# EAGLE design programmer (EAGLE 9.6.2)
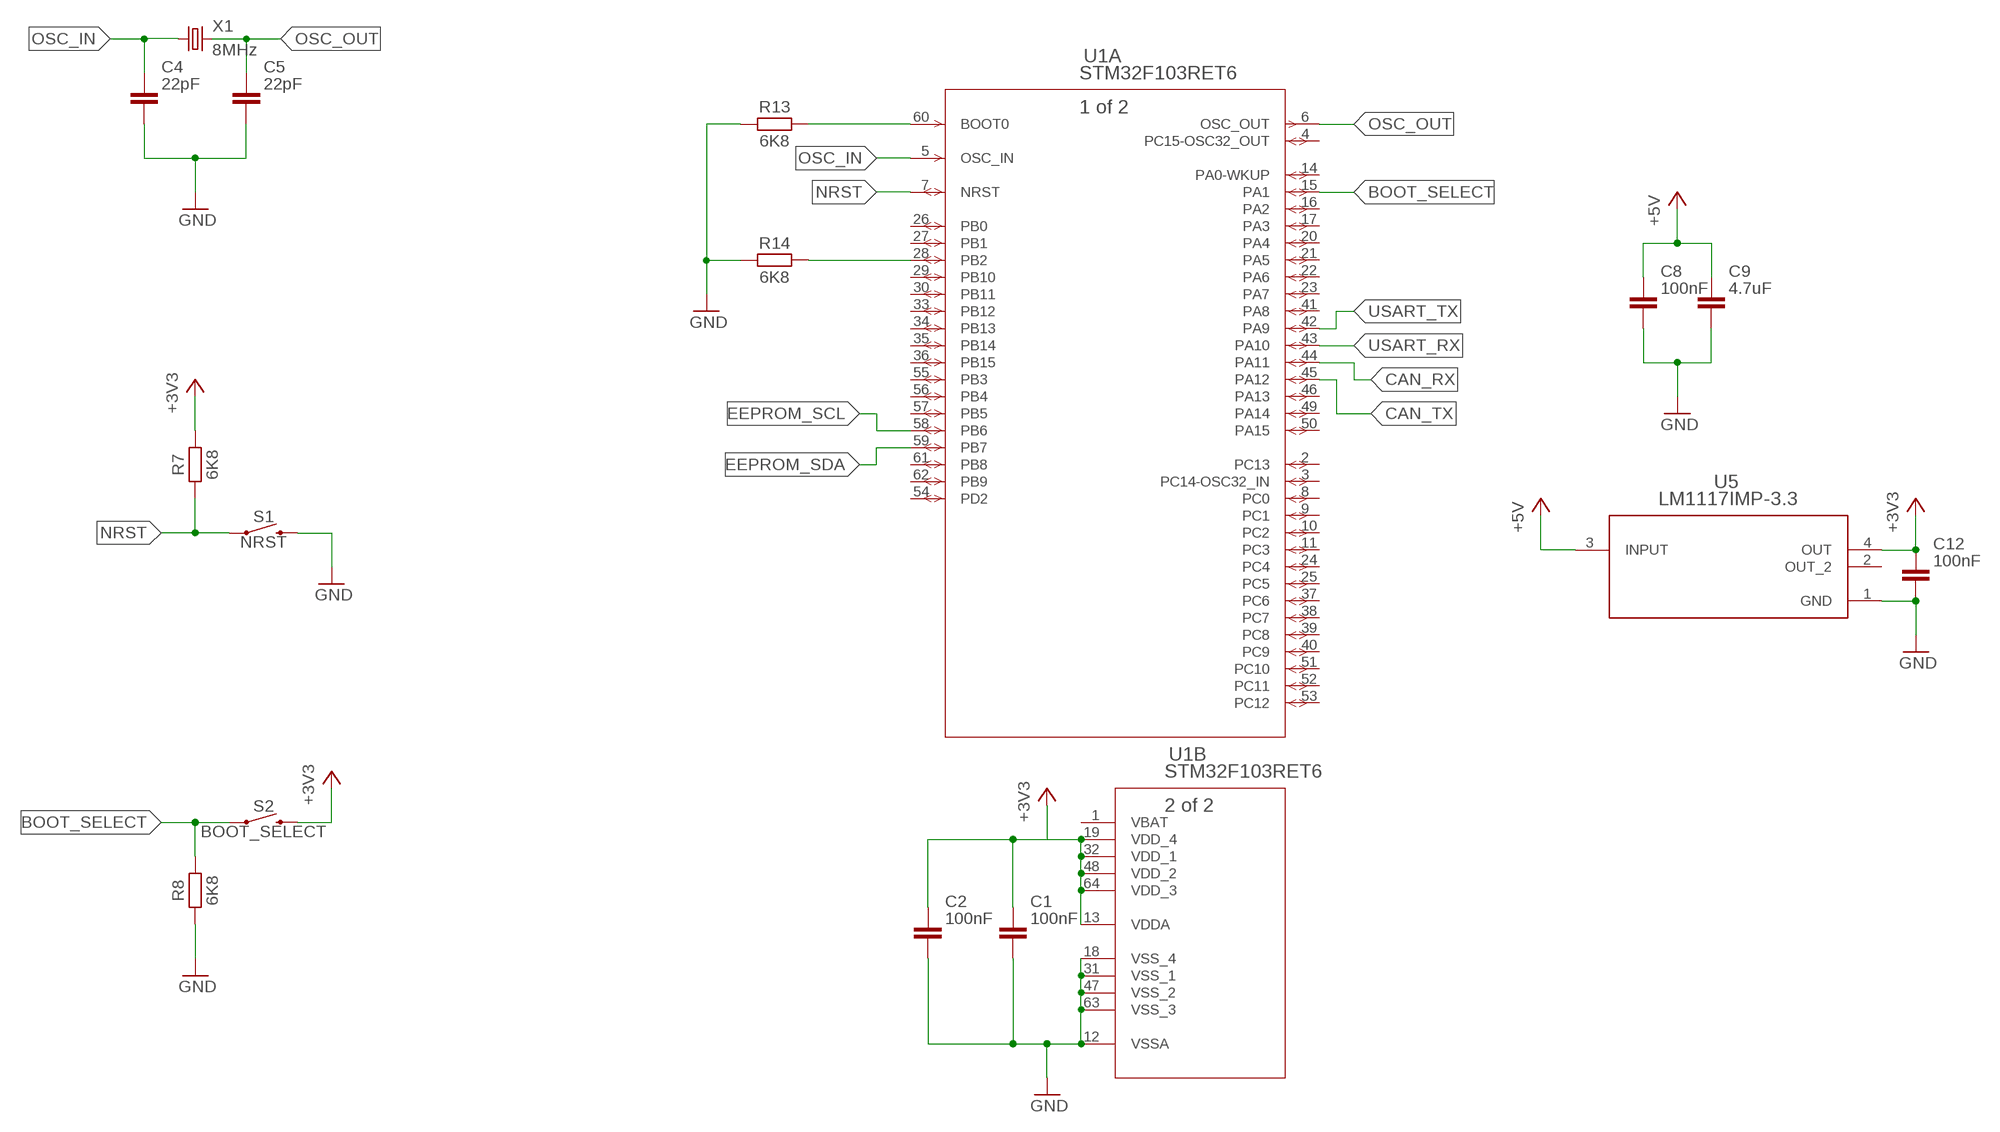
[diagram p0: schematic, sheet 1, part 1 of 2]
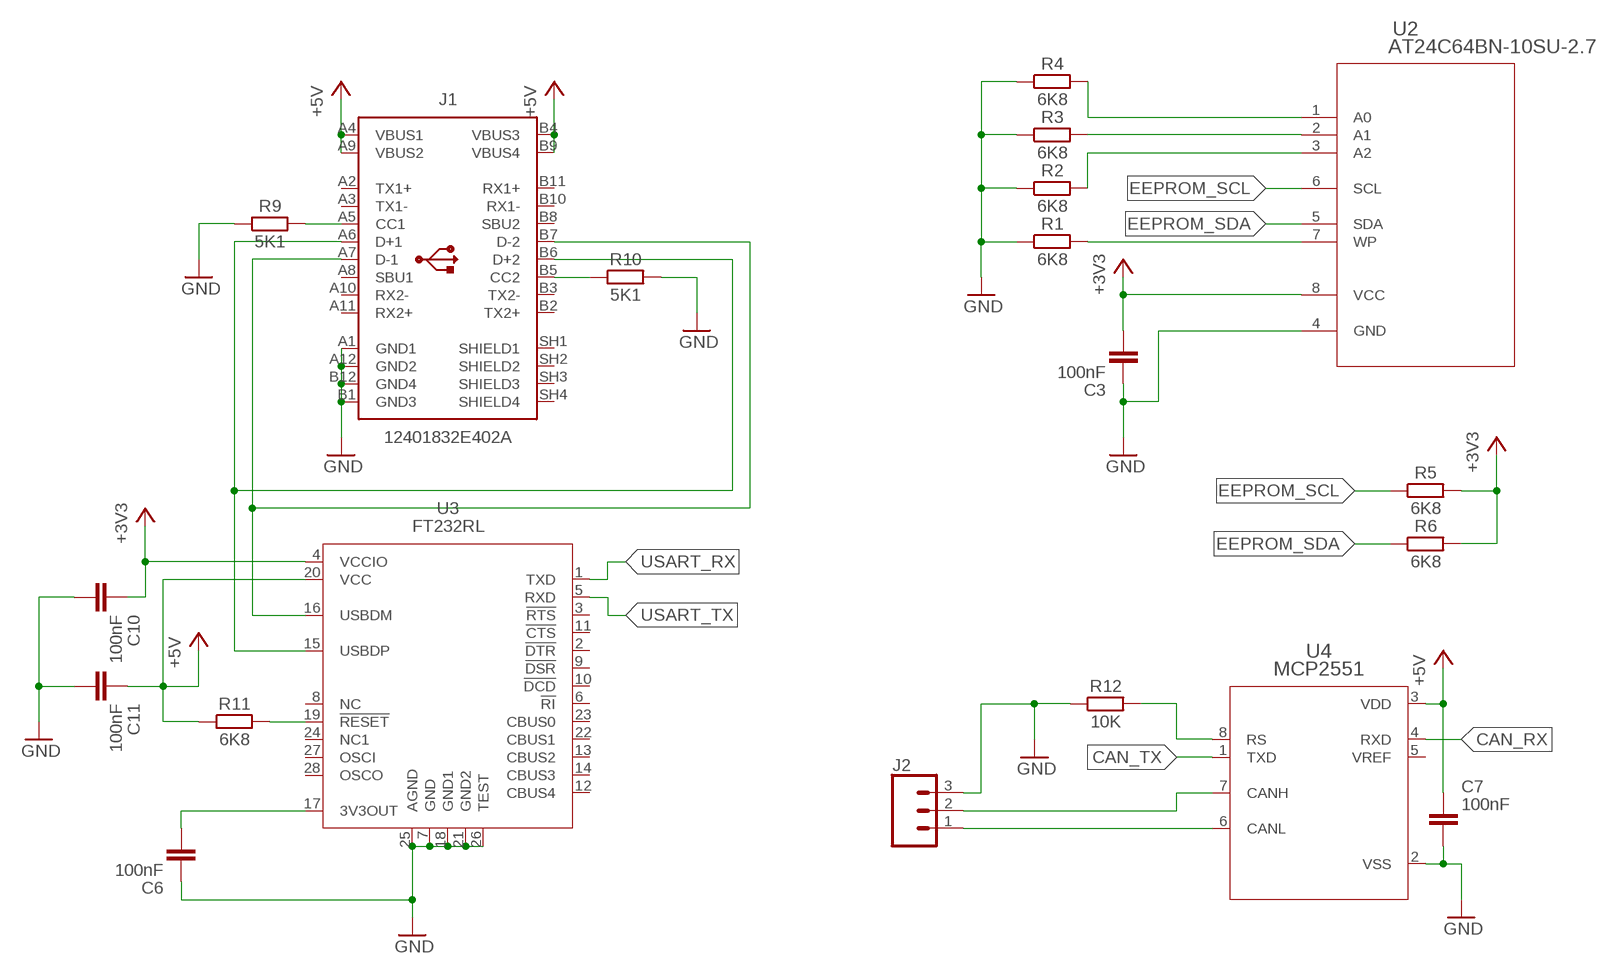
[diagram p1: schematic, sheet 1, part 2 of 2]

## Parts
C1  100nF  C_CHIP-0805(2012-METRIC)  [CAPC2012X110]
C2  100nF  C_CHIP-0805(2012-METRIC)  [CAPC2012X110]
C3  100nF  C_CHIP-0805(2012-METRIC)  [CAPC2012X110]
C4  22pF  C_CHIP-0805(2012-METRIC)  [CAPC2012X110]
C5  22pF  C_CHIP-0805(2012-METRIC)  [CAPC2012X110]
C6  100nF  C_CHIP-0805(2012-METRIC)  [CAPC2012X110]
C7  100nF  C_CHIP-0805(2012-METRIC)  [CAPC2012X110]
C8  100nF  C_CHIP-0805(2012-METRIC)  [CAPC2012X110]
C9  4.7uF  C_CHIP-0805(2012-METRIC)  [CAPC2012X110]
C10  100nF  C_CHIP-0805(2012-METRIC)  [CAPC2012X110]
C11  100nF  C_CHIP-0805(2012-METRIC)  [CAPC2012X110]
C12  100nF  C_CHIP-0805(2012-METRIC)  [CAPC2012X110]
J1  12401832E402A  [12401832E402A]
J2  CONN_03-SCREW-5MM  [SCREWTERMINAL-5MM-3]
R1  6K8  R_CHIP-0805(2012-METRIC)  [RESC2012X65]
R2  6K8  R_CHIP-0805(2012-METRIC)  [RESC2012X65]
R3  6K8  R_CHIP-0805(2012-METRIC)  [RESC2012X65]
R4  6K8  R_CHIP-0805(2012-METRIC)  [RESC2012X65]
R5  6K8  R_CHIP-0805(2012-METRIC)  [RESC2012X65]
R6  6K8  R_CHIP-0805(2012-METRIC)  [RESC2012X65]
R7  6K8  R_CHIP-0805(2012-METRIC)  [RESC2012X65]
R8  6K8  R_CHIP-0805(2012-METRIC)  [RESC2012X65]
R9  5K1  R_CHIP-0805(2012-METRIC)  [RESC2012X65]
R10  5K1  R_CHIP-0805(2012-METRIC)  [RESC2012X65]
R11  6K8  R_CHIP-0805(2012-METRIC)  [RESC2012X65]
R12  10K  R_CHIP-0805(2012-METRIC)  [RESC2012X65]
R13  6K8  R_CHIP-0805(2012-METRIC)  [RESC2012X65]
R14  6K8  R_CHIP-0805(2012-METRIC)  [RESC2012X65]
S1  NRST  MOMENTARY-SWITCH-SPST-SMD-6.0X3.5MM  [TACTILE_SWITCH_SMD_6.0X3.5MM]
S2  BOOT_SELECT  MOMENTARY-SWITCH-SPST-SMD-6.0X3.5MM  [TACTILE_SWITCH_SMD_6.0X3.5MM]
U1  STM32F103RET6  [LQFP64-10X10MM]
U2  AT24C64BN-10SU-2.7  [8S1_ATM]
U3  FT232RL  FT232RL_SSOP  [SSOP28]
U4  MCP2551  MCP2551_SOIC  [SOIC127P599X175-8]
U5  LM1117IMP-3.3  LM1117IMP-3.3/NOPB  [DCY0004A_N]
X1  8MHz  CRYSTALS-NOGND-4-HSMX  [HC49-4-HSMX]

## Nets
+3V3: C1.1 C2.1 C3.2 C10.1 C12.1 R5.2 R6.2 R7.2 S2.2 U1.13(B:VDDA) U1.19(B:VDD_4) U1.32(B:VDD_1) U1.48(B:VDD_2) U1.64(B:VDD_3) U2.8(VCC) U3.4(VCCIO) U5.4(OUT)
+5V: C7.1 C8.1 C9.1 C11.1 J1.A4(VBUS1) J1.A9(VBUS2) J1.B4(VBUS3) J1.B9(VBUS4) R11.1 U3.20(VCC) U4.3(VDD) U5.3(INPUT)
BOOT_SELECT: R8.2 S2.1 U1.15(A:PA1)
CAN_RX: U1.44(A:PA11) U4.4(RXD)
CAN_TX: U1.45(A:PA12) U4.1(TXD)
EEPROM_SCL: R5.1 U1.58(A:PB6) U2.6(SCL)
EEPROM_SDA: R6.1 U1.59(A:PB7) U2.5(SDA)
GND: C1.2 C2.2 C3.1 C4.2 C5.2 C6.1 C7.2 C8.2 C9.2 C10.2 C11.2 C12.2 J1.A1(GND1) J1.A12(GND2) J1.B1(GND3) J1.B12(GND4) J2.3 R1.1 R2.1 R3.1 R4.1 R8.1 R9.1 R10.2 R12.1 R13.1 R14.1 S1.2 U1.12(B:VSSA) U1.18(B:VSS_4) U1.31(B:VSS_1) U1.47(B:VSS_2) U1.63(B:VSS_3) U2.4(GND) U3.7(GND) U3.18(GND1) U3.21(GND2) U3.25(AGND) U3.26(TEST) U4.2(VSS) U5.1(GND)
N$1: R2.2 U2.3(A2)
N$2: R3.2 U2.2(A1)
N$3: R4.2 U2.1(A0)
N$4: R1.2 U2.7(WP)
N$5: R12.2 U4.8(RS)
N$6: R14.2 U1.28(A:PB2)
N$7: J2.2 U4.7(CANH)
N$8: J2.1 U4.6(CANL)
N$9: R13.2 U1.60(A:BOOT0)
N$10: C6.2 U3.17(3V3OUT)
N$13: J1.A5(CC1) R9.2
N$14: J1.A6(D+1) J1.B6(D+2) U3.15(USBDP)
N$15: R11.2 U3.19(!RESET)
N$16: J1.A7(D-1) J1.B7(D-2) U3.16(USBDM)
N$17: J1.B5(CC2) R10.1
NRST: R7.1 S1.1 U1.7(A:NRST)
OSC_IN: C4.1 U1.5(A:OSC_IN) X1.1
OSC_OUT: C5.1 U1.6(A:OSC_OUT) X1.2
USART_RX: U1.43(A:PA10) U3.1(TXD)
USART_TX: U1.42(A:PA9) U3.5(RXD)
Unconnected: J1.A2(TX1+) J1.A3(TX1-) J1.A8(SBU1) J1.A10(RX2-) J1.A11(RX2+) J1.B2(TX2+) J1.B3(TX2-) J1.B8(SBU2) J1.B10(RX1-) J1.B11(RX1+) J1.SH1(SHIELD1) J1.SH2(SHIELD2) J1.SH3(SHIELD3) J1.SH4(SHIELD4) U1.2(A:PC13) U1.3(A:PC14-OSC32_IN) U1.4(A:PC15-OSC32_OUT) U1.8(A:PC0) U1.9(A:PC1) U1.10(A:PC2) U1.11(A:PC3) U1.14(A:PA0-WKUP) U1.16(A:PA2) U1.17(A:PA3) U1.20(A:PA4) U1.21(A:PA5) U1.22(A:PA6) U1.23(A:PA7) U1.24(A:PC4) U1.25(A:PC5) U1.26(A:PB0) U1.27(A:PB1) U1.29(A:PB10) U1.30(A:PB11) U1.33(A:PB12) U1.34(A:PB13) U1.35(A:PB14) U1.36(A:PB15) U1.37(A:PC6) U1.38(A:PC7) U1.39(A:PC8) U1.40(A:PC9) U1.41(A:PA8) U1.46(A:PA13) U1.49(A:PA14) U1.50(A:PA15) U1.51(A:PC10) U1.52(A:PC11) U1.53(A:PC12) U1.54(A:PD2) U1.55(A:PB3) U1.56(A:PB4) U1.57(A:PB5) U1.61(A:PB8) U1.62(A:PB9) U3.2(!DTR) U3.3(!RTS) U3.6(!RI) U3.8(NC) U3.9(!DSR) U3.10(!DCD) U3.11(!CTS) U3.12(CBUS4) U3.13(CBUS2) U3.14(CBUS3) U3.22(CBUS1) U3.23(CBUS0) U3.24(NC1) U3.27(OSCI) U3.28(OSCO) U4.5(VREF)

## Power pins joined to a net without a drawn wire
OUT_2: U5.2(OUT_2)
VBAT: U1.1(B:VBAT)

## Library data of the parts
C1-C12 = Capacitor:C: Capacitor - Generic; CATEGORY: Capacitor
J1 = Connector_USB:12401832E402A: USB(3.1) Type-C, RCPT, 24POS, SMD-THT-R/A Datasheet <https://cdn.amphenol-icc.com/media/wysiwyg/files/documentation/datasheet/inputoutput/io_usb_type_c.pdf> Drawing <https://cdn.amphenol-icc.com/media/wysiwyg/files/drawing/c12401832e402a.pdf>; CATEGORY: Connector; CONTACTS: 24; CURRENT_RATING: 5A; DESCRIPTION: CONN RCP USB3.1 TYPEC 24P SMD RA; GENDER: Receptacle; MANUFACTURER: Amphenol ICC; MOUNT_TYPE: R/A; MPN: 12401832E402A; PART_STATUS: Active; ROHS_COMPLIANT: COMPLIANT; SUB-CATEGORY: USB; TYPE: USB-C
J2 = SparkFun-Connectors:CONN_03: Multi connection point. Often used as Generic Header-pin footprint for 0.1 inch spaced/style header connections On any of the 0.1 inch spaced packages, you can populate with these: Break Away Headers - Straight <https://www.sparkfun.com/products/116> (PRT-00116) Break Away Male Headers - Right Angle <https://www.sparkfun.com/products/553> (PRT-00553) Female Headers <https://www.sparkfun.com/products/115> (PRT-00115) Break Away Headers - Machine Pin <https://www.sparkfun.com/products/117> (PRT-00117) Break Away Female Headers - Swiss Machine Pin <https://www.sparkfun.com/products/743> (PRT-00743) Stackable Header - 3 Pin (Female, 0.1") <https://www.sparkfun.com/products/13875> (PRT-13875) For SCREWTERMINALS and SPRING TERMINALS visit here: Screw Terimnals on SparkFun.com <https://www.sparkfun.com/search/results?term=Screw+Terminals> (5mm/3.5mm/2.54mm spacing) This device is also useful as a general connection point to wire up your design to another part of your project. Our various solder wires solder well into these plated through hole pads. Hook-Up Wire - Assortment (Stranded, 22 AWG) <https://www.sparkfun.com/products/11375> (PRT-11375) Hook-Up Wire - Assortment (Solid Core, 22 AWG) <https://www.sparkfun.com/products/11367> (PRT-11367) View the entire wire category on our website here <https://www.sparkfun.com/categories/141> Special notes: Molex polarized connector foot print use with SKU : PRT-08232 with associated crimp pins and housings.; PROD_ID: CONN-10134; SF_SKU: PRT-08433
R1-R14 = Resistor:R: Resistor Fixed - Generic; CATEGORY: Resistor; SUB-CATEGORY: Fixed
S1 S2 = SparkFun-Switches:MOMENTARY-SWITCH-SPST: Momentary Switch (Pushbutton) - SPST Normally-open (NO) SPST momentary switches (buttons, pushbuttons). Variants PTH-12MM - 12mm square, through-hole Momentary Pushbutton Switch - 12mm Square <https://www.sparkfun.com/products/9190> (COM-09190) PTH-6.0MM, PTH-6.0MM-KIT - 6.0mm square, through-hole Mini Pushbutton Switch <https://www.sparkfun.com/products/97> (COM-00097) KIT package intended for soldering kit's - only one side of pads' copper is exposed. PTH-RIGHT-ANGLE-KIT - Right-angle, through-hole Right Angle Tactile Button <https://www.sparkfun.com/products/10791> - Used on SparkFun BigTime Watch Kit <https://www.sparkfun.com/products/11734> SMD-12MM - 12mm square, surface-mount Tactile Button - SMD (12mm) <https://www.sparkfun.com/products/12993> (COM-12993) Used on SparkFun PicoBoard <https://www.sparkfun.com/products/11888> SMD-4.5MM - 4.5mm Square Trackball Switch Used on SparkFun Blackberry Trackballer Breakout <https://www.sparkfun.com/products/13169> SMD-4.6MMX2.8MM - 4.60mm x 2.80mm, surface mount Used on SparkFun SAMD21 Mini Breakout <https://www.sparkfun.com/products/13664> SMD-5.2MM, SMD-5.2-REDUNDANT - 5.2mm square, surface-mount Mini Pushbutton Switch - SMD <https://www.sparkfun.com/products/8720> (COM-08720) Used on Arduino Pro Mini <https://www.sparkfun.com/products/11114> REDUNDANT package connects both switch circuits together SMD-6.0X3.5MM - 6.0 x 3.5mm, surface mount Momentary Reset Switch SMD <https://www.sparkfun.com/products/8229> (COM-08229) SMD-6.2MM-TALL - 6.2mm square, surface mount Tactile Button - SMD (6mm) <https://www.sparkfun.com/products/12992> Used on SparkFun Digital Sandbox <https://www.sparkfun.com/products/12651> SMD-RIGHT-ANGLE - Right-angle, surface mount Used on SparkFun Block for Intel® Edison - Arduino <https://www.sparkfun.com/products/13036>; PROD_ID: SWCH-00815; SF_SKU: COM-08229
U1 = STM32F103RET6:STM32F103RET6; BUILT_BY: EMA_UL_Team; COPYRIGHT: Copyright (C) 2018 Accelerated Designs. All rights reserved; MANUFACTURER_PART_NUMBER: STM32F103RET6; SOURCELIBRARY: Updates_to_database_2020-10-19; VENDOR: STMicroelectronics
U2 = AT24C64BN-10SU:AT24C64BN-10SU-2.7; BUILT_BY: EMA_UL_Team; MANUFACTURER_PART_NUMBER: AT24C64BN-10SU-2.7; SOURCELIBRARY: Atmel_2015-02-13; VENDOR: Atmel
U3 = IC_Interface:FT232RL: USB Bridge, USB to UART USB 2.0 UART Interface Datasheet <https://www.ftdichip.com/Support/Documents/DataSheets/ICs/DS_FT232R.pdf>; CATEGORY: IC_Interface; MANUFACTURER: FTDI Chip; MPN: FT232RL; OPERATING_TEMP: -40 to 85°C; PART_STATUS: Active; ROHS_COMPLIANT: Compliant; SUB-CATEGORY: Controller; THERMALLOSS: 0.5W; TYPE: USB to UART
U4 = IC_Interface:MCP2551: High - Speed CAN Transceiver Datasheet <http://ww1.microchip.com/downloads/en/devicedoc/20001667g.pdf>; CATEGORY: IC_Interface; MANUFACTURER: Microchip; MPN: MCP2551-E/SN; OPERATING_TEMP: -40 to +125 °C; PART_STATUS: Active; SUB-CATEGORY: Transceiver
U5 = LM1117IMP-3.3:LM1117IMP-3.3/NOPB; MANUFACTURER: Texas Instruments; PARTNUMBER: LM1117IMP-3.3/NOPB; REFDES: RefDes; TYPE: TYPE; VALUE: Value
X1 = IQD-Frequency-Products:CRYSTALS-NOGND: CRYSTALS CAN NOT GROUNDED

## Board
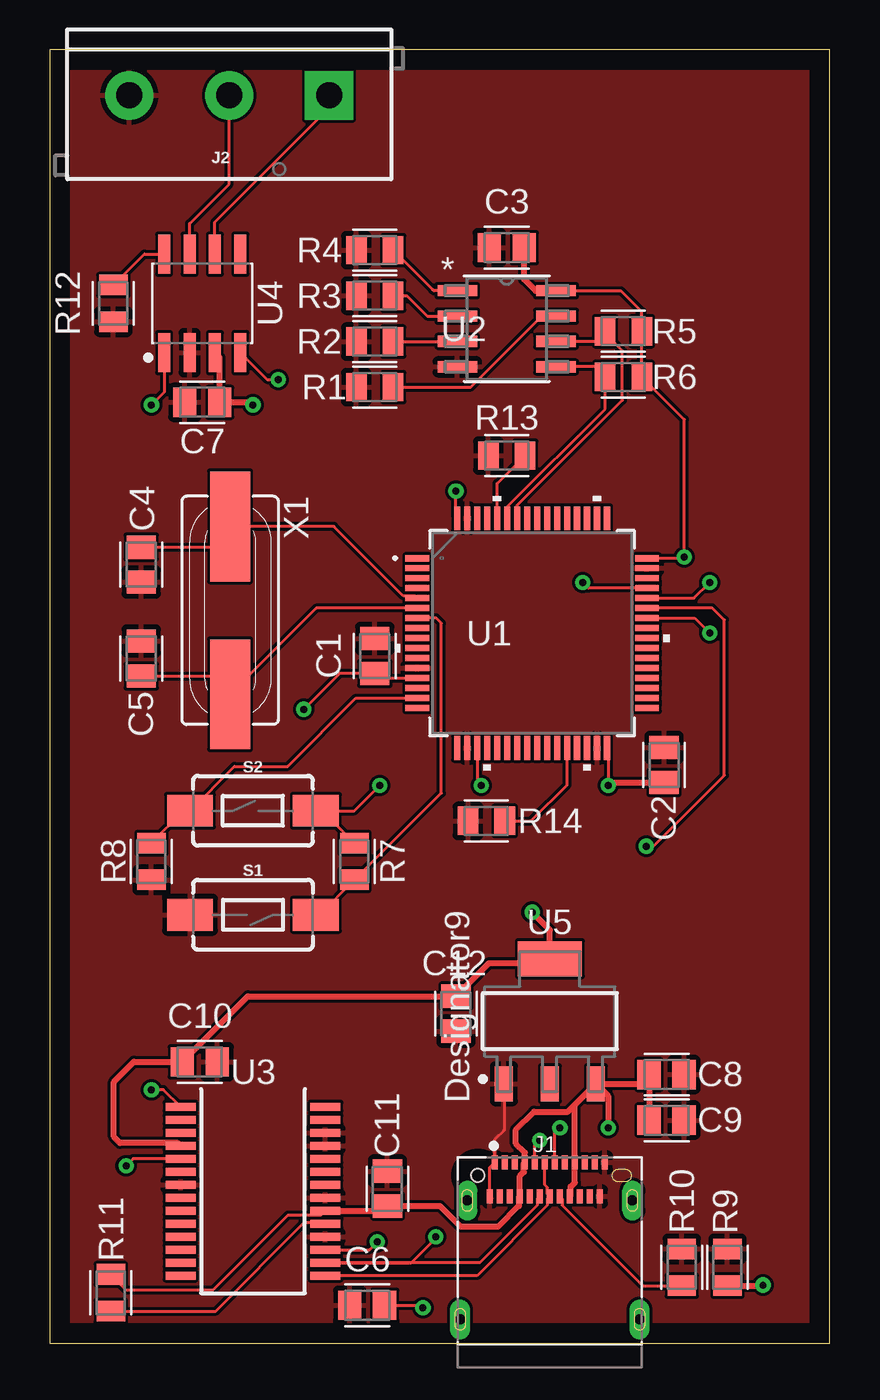
[diagram p2: board, top side]
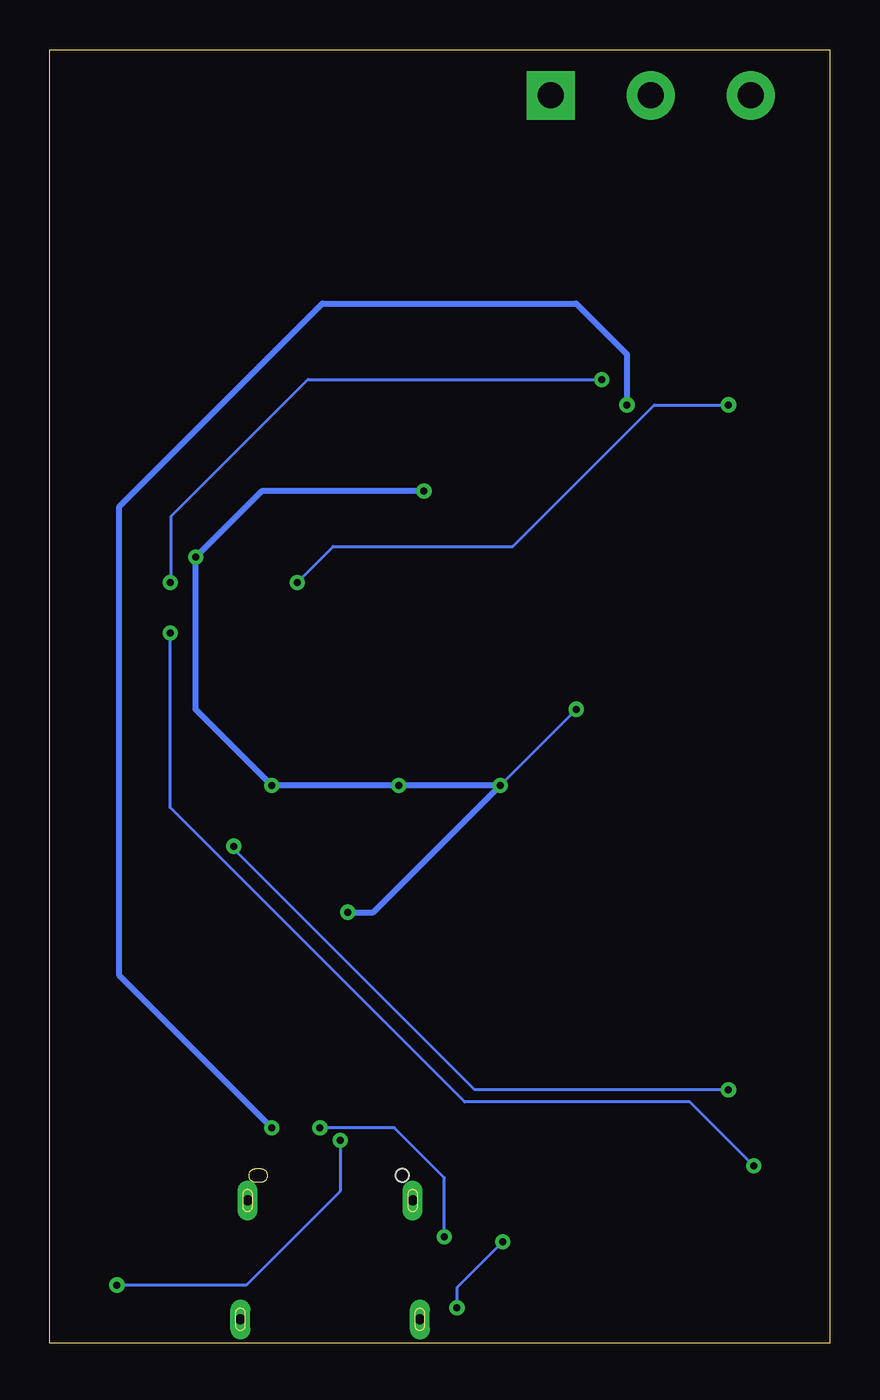
[diagram p3: board, bottom side, seen from below]

Size 39.04 x 64.76 mm. Coordinates in mm from the lower left corner, seen from the top.
Outline: 0,0 39.04,0 39.04,64.76 0,64.76 0,0
Copper layers (1*16): Top 0.035mm / dielectric 1.5mm / Bottom 0.035mm
Design rules "default": minimum track width 6mil, minimum drill 0.35mm, track to track 6mil, track to pad 6mil, pad to pad 6mil, via to via 6mil, smd to smd 6mil, copper to edge 40mil, drill to drill 6mil, minimum pad ring 10mil, minimum via ring 8mil, stop-mask expansion 4mil, vias tented up to drill 0mil, thermal gap 10mil

### Footprints (pad centres in the part's own frame; a part is rotated, then mirrored left to right if it is on the bottom)
CAPC2012X110 = smd 1.165 x 1.465: 1 -0.875,0; 2 0.875,0
12401832E402A = smd 0.3 x 0.7: A1 -2.75,5; A2 -2.25,5; A3 -1.75,5; A4 -1.25,5; A5 -0.75,5; A6 -0.25,5; A7 0.25,5; A8 0.75,5; A9 1.25,5; A10 1.75,5; A11 2.25,5; A12 2.75,5; B1 2.5,3.3; B2 2,3.3; B3 1.5,3.3; B4 1,3.3; B5 0.5,3.3; B6 0,3.3; B7 -0.5,3.3; B8 -1,3.3; B9 -1.5,3.3; B10 -2,3.3; B11 -2.5,3.3; B12 -3,3.3 | drill 0.5 pad 0.8 long: SH1 -4.13,3.09; SH2 4.13,3.09; SH3 4.49,-2.86; SH4 -4.49,-2.86 | hole 0.65: -3.6,4.34
SCREWTERMINAL-5MM-3 = drill 1.3 pad 2.413 square: 1 0,0 | drill 1.3 pad 2.413: 2 5,0; 3 10,0
RESC2012X65 = smd 1.031 x 1.42: 1 -0.919,0; 2 0.919,0
TACTILE_SWITCH_SMD_6.0X3.5MM = smd 2.3 x 1.6: 1 -3.15,0; 2 3.15,0
LQFP64-10X10MM = smd 1.194 x 0.305: 1 -5.75,3.75; 2 -5.75,3.25; 3 -5.75,2.75; 4 -5.75,2.25; 5 -5.75,1.75; 6 -5.75,1.25; 7 -5.75,0.75; 8 -5.75,0.25; 9 -5.75,-0.25; 10 -5.75,-0.75; 11 -5.75,-1.25; 12 -5.75,-1.75; 13 -5.75,-2.25; 14 -5.75,-2.75; 15 -5.75,-3.25; 16 -5.75,-3.75; 33 5.75,-3.75; 34 5.75,-3.25; 35 5.75,-2.75; 36 5.75,-2.25; 37 5.75,-1.75; 38 5.75,-1.25; 39 5.75,-0.75; 40 5.75,-0.25; 41 5.75,0.25; 42 5.75,0.75; 43 5.75,1.25; 44 5.75,1.75; 45 5.75,2.25; 46 5.75,2.75; 47 5.75,3.25; 48 5.75,3.75 | smd 0.305 x 1.194: 17 -3.75,-5.75; 18 -3.25,-5.75; 19 -2.75,-5.75; 20 -2.25,-5.75; 21 -1.75,-5.75; 22 -1.25,-5.75; 23 -0.75,-5.75; 24 -0.25,-5.75; 25 0.25,-5.75; 26 0.75,-5.75; 27 1.25,-5.75; 28 1.75,-5.75; 29 2.25,-5.75; 30 2.75,-5.75; 31 3.25,-5.75; 32 3.75,-5.75; 49 3.75,5.75; 50 3.25,5.75; 51 2.75,5.75; 52 2.25,5.75; 53 1.75,5.75; 54 1.25,5.75; 55 0.75,5.75; 56 0.25,5.75; 57 -0.25,5.75; 58 -0.75,5.75; 59 -1.25,5.75; 60 -1.75,5.75; 61 -2.25,5.75; 62 -2.75,5.75; 63 -3.25,5.75; 64 -3.75,5.75
8S1_ATM = smd 1.981 x 0.561: 1 -2.465,1.905; 2 -2.465,0.635; 3 -2.465,-0.635; 4 -2.465,-1.905; 5 2.465,-1.905; 6 2.465,-0.635; 7 2.465,0.635; 8 2.465,1.905
SSOP28 = smd 0.4 x 1.5: 1 -4.225,-3.625; 2 -3.575,-3.625; 3 -2.925,-3.625; 4 -2.275,-3.625; 5 -1.625,-3.625; 6 -0.975,-3.625; 7 -0.325,-3.625; 8 0.325,-3.625; 9 0.975,-3.625; 10 1.625,-3.625; 11 2.275,-3.625; 12 2.925,-3.625; 13 3.575,-3.625; 14 4.225,-3.625; 15 4.225,3.625; 16 3.575,3.625; 17 2.925,3.625; 18 2.275,3.625; 19 1.625,3.625; 20 0.975,3.625; 21 0.325,3.625; 22 -0.325,3.625; 23 -0.975,3.625; 24 -1.625,3.625; 25 -2.275,3.625; 26 -2.925,3.625; 27 -3.575,3.625; 28 -4.225,3.625
SOIC127P599X175-8 = smd 1.967 x 0.599: 1 -2.469,1.905; 2 -2.469,0.635; 3 -2.469,-0.635; 4 -2.469,-1.905; 5 2.469,-1.905; 6 2.469,-0.635; 7 2.469,0.635; 8 2.469,1.905
DCY0004A_N = smd 1.75 x 0.9: 1 -3.125,2.3; 2 -3.125,0; 3 -3.125,-2.3 | smd 1.75 x 3.2: 4 3.125,0
HC49-4-HSMX = smd 5.5 x 2: 1 -4.2,0; 2 4.2,0

### Placement (x,y rotation side)
C1  16.26,34.42 90 top
C2  30.73,28.96 90 top
C3  22.86,54.86 0 top
C4  4.57,38.99 270 top
C5  4.57,34.29 90 top
C6  15.88,1.91 0 top
C7  7.62,47.12 180 top
C8  30.86,13.46 0 top
C9  30.86,11.18 0 top
C10  7.49,14.1 0 top
C11  16.89,7.75 90 top
C12  20.32,16.51 270 top
J1  25.02,4.06 0 top
J2  13.97,62.48 180 top
R1  16.26,47.88 0 top
R2  16.26,50.16 0 top
R3  16.26,52.45 0 top
R4  16.26,54.74 0 top
R5  28.7,50.67 0 top
R6  28.7,48.39 0 top
R7  15.24,24.13 90 top
R8  5.08,24.13 90 top
R9  33.91,3.81 270 top
R10  31.62,3.81 90 top
R11  3.05,2.54 270 top
R12  3.17,52.07 90 top
R13  22.86,44.45 0 top
R14  21.84,26.16 0 top
S1  10.16,21.46 180 top
S2  10.16,26.67 0 top
U1  24.13,35.56 0 top
U2  22.86,50.8 0 top
U3  10.16,7.62 270 top
U4  7.62,52.07 90 top
U5  25.02,16.13 90 top
X1  9.02,36.7 270 top

### Tracks (layer width: path | path; a pad name or v marks a point on that pad's centre or on a via)
+3V3  (via drill 0.35)
  Top 0.152: U2.8 28.57,52.7 29.62,51.66 R5.2 R6.2 31.75,46.26 v31.75,39.37 31.69,39.31 U1.48 | R7.2 13.62,26.67 S2.2 15.24,26.67 v16.51,27.94 | U1.13 16.49,33.31 C1.1 14.49,33.54 v12.7,31.75 | U1.64 20.32,41.37 v20.32,42.67 | U1.32 27.94,29.75 v27.94,27.94 | U1.19 21.38,28.15 v21.59,27.94
  Top 0.305: U3.4 6.39,10.04 3.5,10.04 3.19,10.35 3.19,13.09 4.21,14.1 C10.1 9.91,17.39 C12.1 21.98,19.05 25.02,19.05 U5.4 25.02,20.7 v24.13,21.59 | U2.8 24.31,52.7 23.73,53.28 C3.2 | v27.94,27.94 28.08,28.08 C2.1
  Bottom 0.152: v16.51,27.94 v12.7,31.75
  Bottom 0.305: v24.13,21.59 22.86,21.59 v16.51,27.94 v21.59,27.94 v27.94,27.94 31.75,31.75 v31.75,39.37 28.45,42.67 v20.32,42.67
+5V  (via drill 0.35)
  Top 0.152: U3.20 13.56,6.42 11.91,6.42 8.16,2.67 3.81,2.67 3.05,3.43 R11.1
  Top 0.305: 26.27,11.95 J1.A9 26.27,8.04 26.06,7.84 26.06,7.41 J1.B4 | 26.27,11.95 U5.3 | U5.3 29.53,13 C8.1 C9.1 | U3.20 16.66,6.64 C11.1 19.52,6.87 20.55,5.84 22.43,5.84 23.47,6.89 23.47,7.32 J1.B9 23.52,8.38 23.72,8.59 23.72,9.02 J1.A4 23.77,9.55 23.32,10 23.32,10.7 24.23,11.61 25.92,11.61 26.27,11.95 | U4.3 8.5,49.36 C7.1 10.03,47.12 v10.16,46.99 | U5.3 27.94,12.38 v27.94,10.79
  Bottom 0.305: v27.94,10.79 35.56,18.41 35.56,41.91 25.4,52.07 12.7,52.07 10.16,49.53 v10.16,46.99
BOOT_SELECT
  Top 0.152: R8.2 6.7,26.67 S2.1 9.23,28.89 11.89,28.89 15.31,32.31 U1.15
CAN_RX  (via drill 0.35)
  Top 0.152: U4.4 10.87,48.26 v11.43,48.26 | U1.44 32.23,37.31 v33.02,38.1
  Bottom 0.152: v33.02,38.1 32.99,38.13 32.99,41.4 26.13,48.26 v11.43,48.26
CAN_TX  (via drill 0.35)
  Top 0.152: U4.1 5.71,47.62 v5.08,46.99 | U1.45 26.96,37.81 v26.67,38.1
  Bottom 0.152: v26.67,38.1 24.86,39.91 15.88,39.91 8.79,46.99 v5.08,46.99
EEPROM_SCL
  Top 0.152: U2.6 27.27,50.16 R5.1 | R5.1 27.78,50.16 | R5.1 27.78,50.57 28.65,49.7 28.65,47.23 23.37,41.94 U1.58
EEPROM_SDA
  Top 0.152: U2.5 27.27,48.9 R6.1 27.78,46.78 22.87,41.88 U1.59
GND
  Top 0.152: 15.34,50.04 R2.1 | 6.83,21.46 S1.2 | 20.88,26.21 R14.1 | J1.B12 22.02,8.81 J1.A1 22.27,10.21 22.73,10.67 22.73,12.83
  Top 0.305: 27.77,8.89 J1.A12 | 20.32,15.4 C12.2 | C10.2 8.37,13.97 | U2.4 20.45,48.95
  pour Top: 0,64.77 39.37,64.77 39.37,0 0,0
N$1
  Top 0.152: R2.2 U2.3
N$2
  Top 0.152: R3.2 17.86,52.45 18.87,51.44 U2.2
N$3
  Top 0.152: U2.1 19.23,52.7 19.18,52.76 19.16,52.76 R4.2
N$4
  Top 0.152: U2.7 24.62,51.44 21.06,47.88 R1.2
N$5
  Top 0.152: R12.2 4.72,54.54 U4.8
N$6
  Top 0.152: R14.2 24.07,26.16 25.88,27.97 U1.28
N$7
  Top 0.152: U4.7 6.99,56.06 8.97,58.05 J2.2
N$8
  Top 0.152: U4.6 8.25,56.15 13.97,61.86 J2.1
N$9
  Top 0.152: U1.60 22.38,43.05 R13.2
N$10  (via drill 0.35)
  Top 0.152: U3.17 16,4.7 v16.38,5.08 | C6.2 18.54,1.91 v18.67,1.78
  Bottom 0.152: v16.38,5.08 18.67,2.79 v18.67,1.78
N$13  (via drill 0.35)
  Top 0.152: J1.A5 24.27,9.92 v24.51,10.16
  Top 0.305: R9.2 35.66,2.89 v35.69,2.92
  Bottom 0.152: v24.51,10.16 24.51,7.62 29.21,2.92 v35.69,2.92
N$14
  Top 0.152: U3.15 21.37,3.4 24.9,6.92 24.9,7.24 J1.B6 24.9,7.49 24.9,7.81 24.77,7.94 J1.A6
N$15
  Top 0.152: R11.2 8.3,1.62 12.71,6.03 13.75,6.03 U3.19
N$16  (via drill 0.35)
  Top 0.152: J1.A7 25.27,10.54 v25.53,10.79 | J1.B7 24.4,7.24 24.4,6.92 21.52,4.04 U3.16 18.09,4.04 19.3,5.26 v19.3,5.33
  Bottom 0.152: v19.3,5.33 19.3,8.29 21.81,10.79 v25.53,10.79
N$17
  Top 0.152: J1.B5 25.64,7.25 25.64,6.92 29.67,2.89 R10.1
NRST
  Top 0.152: S1.1 13.49,21.46 R7.1 19.59,27.56 19.59,36.06 19.33,36.32 U1.7
OSC_IN
  Top 0.152: C4.1 8.36,39.86 9.02,40.52 X1.1 14.21,40.9 17.69,37.43 18.26,37.43 U1.5
OSC_OUT
  Top 0.152: C5.1 8.11,33.41 X1.2 13.32,36.81 U1.6
USART_RX  (via drill 0.35)
  Top 0.152: U1.43 29.9,36.83 33.15,36.83 33.75,36.22 33.75,28.45 30.2,24.89 v29.84,24.89 | U3.1 5.68,12.7 v5.08,12.7
  Bottom 0.152: v5.08,12.7 17.78,12.7 29.84,24.77 v29.84,24.89
USART_TX  (via drill 0.35)
  Top 0.152: U1.42 32.27,36.31 v33.02,35.56 | U3.5 4.17,9.24 v3.81,8.89
  Bottom 0.152: v3.81,8.89 7.01,12.09 18.29,12.09 33.02,26.83 v33.02,35.56